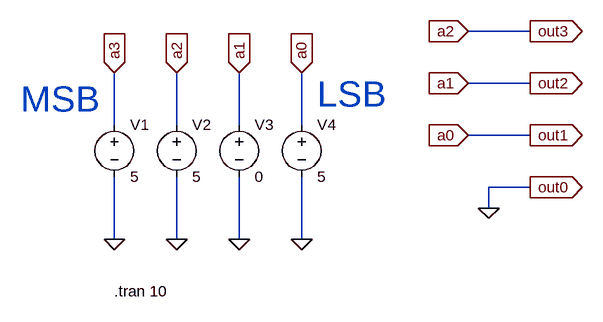
[diagram p0: schematic Left Shift.asc]
Left Shift.asc, the LTspice schematic file:
Version 4
SHEET 1 880 680
WIRE 688 -80 592 -80
WIRE 688 0 592 0
WIRE 48 64 48 -16
WIRE 144 64 144 -16
WIRE 240 64 240 -16
WIRE 336 64 336 -16
WIRE 688 80 592 80
WIRE 688 160 624 160
WIRE 624 192 624 160
WIRE 48 240 48 144
WIRE 144 240 144 144
WIRE 240 240 240 144
WIRE 336 240 336 144
FLAG 48 240 0
FLAG 144 240 0
FLAG 240 240 0
FLAG 336 240 0
FLAG 336 -16 a0
IOPIN 336 -16 In
FLAG 240 -16 a1
IOPIN 240 -16 In
FLAG 144 -16 a2
IOPIN 144 -16 In
FLAG 48 -16 a3
IOPIN 48 -16 In
FLAG 688 160 out0
IOPIN 688 160 Out
FLAG 688 80 out1
IOPIN 688 80 Out
FLAG 688 0 out2
IOPIN 688 0 Out
FLAG 688 -80 out3
IOPIN 688 -80 Out
FLAG 624 192 0
FLAG 592 80 a0
IOPIN 592 80 In
FLAG 592 0 a1
IOPIN 592 0 In
FLAG 592 -80 a2
IOPIN 592 -80 In
SYMBOL voltage 48 48 R0
WINDOW 123 0 0 Left 0
WINDOW 39 0 0 Left 0
SYMATTR InstName V1
SYMATTR Value 5
SYMBOL voltage 144 48 R0
SYMATTR InstName V2
SYMATTR Value 5
SYMBOL voltage 240 48 R0
SYMATTR InstName V3
SYMATTR Value 0
SYMBOL voltage 336 48 R0
WINDOW 123 0 0 Left 0
WINDOW 39 0 0 Left 0
SYMATTR InstName V4
SYMATTR Value 5
TEXT 360 16 Left 5 ;LSB
TEXT -96 24 Left 5 ;MSB
TEXT 48 320 Left 2 !.tran 10

The netlist it stands for:
* Left Shift.asc
V1 a3 0 5
V2 out3 0 5
V3 out2 0 0
V4 out1 0 5
* LSB
* MSB
.tran 10
.backanno
.end